# Altium schematic sheet Sheet5.SchDoc
size A4
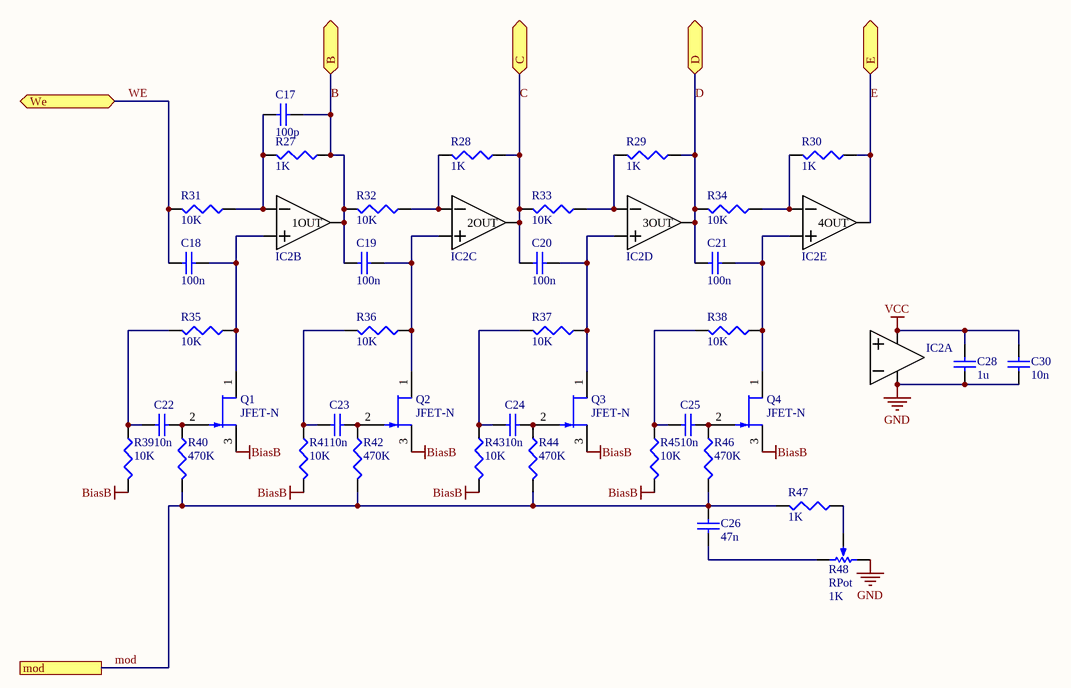
[diagram p0: Sheet5.SchDoc]

## Parts
C17  value 100p  [C1206]  (hidden comment: Cap Semi)
C18  value 100n  [C1206]  (hidden comment: Cap Semi)
C19  value 100n  [C1206]  (hidden comment: Cap Semi)
C20  value 100n  [C1206]  (hidden comment: Cap Semi)
C21  value 100n  [C1206]  (hidden comment: Cap Semi)
C22  value 10n  [C1206]  (hidden comment: Cap Semi)
C23  value 10n  [C1206]  (hidden comment: Cap Semi)
C24  value 10n  [C1206]  (hidden comment: Cap Semi)
C25  value 10n  [C1206]  (hidden comment: Cap Semi)
C26  value 47n  [C1206]  (hidden comment: Cap Semi)
C28  value 1u  [C1206]  (hidden comment: Cap Semi)
C30  value 10n  [C1206]  (hidden comment: Cap Semi)
IC2  TL074A  [TL074A]  (value not drawn)  (parts A,B,C,D,E of 5)
Q1  JFET-N  [TO-254-AA]
Q2  JFET-N  [TO-254-AA]
Q3  JFET-N  [TO-254-AA]
Q4  JFET-N  [TO-254-AA]
R27  value 1K  [J1-0603]  (hidden comment: Res3)
R28  value 1K  [J1-0603]  (hidden comment: Res3)
R29  value 1K  [J1-0603]  (hidden comment: Res3)
R30  value 1K  [J1-0603]  (hidden comment: Res3)
R31  value 10K  [J1-0603]  (hidden comment: Res3)
R32  value 10K  [J1-0603]  (hidden comment: Res3)
R33  value 10K  [J1-0603]  (hidden comment: Res3)
R34  value 10K  [J1-0603]  (hidden comment: Res3)
R35  value 10K  [J1-0603]  (hidden comment: Res3)
R36  value 10K  [J1-0603]  (hidden comment: Res3)
R37  value 10K  [J1-0603]  (hidden comment: Res3)
R38  value 10K  [J1-0603]  (hidden comment: Res3)
R39  value 10K  [J1-0603]  (hidden comment: Res3)
R40  value 470K  [J1-0603]  (hidden comment: Res3)
R41  value 10K  [J1-0603]  (hidden comment: Res3)
R42  value 470K  [J1-0603]  (hidden comment: Res3)
R43  value 10K  [J1-0603]  (hidden comment: Res3)
R44  value 470K  [J1-0603]  (hidden comment: Res3)
R45  value 10K  [J1-0603]  (hidden comment: Res3)
R46  value 470K  [J1-0603]  (hidden comment: Res3)
R47  value 1K  [J1-0603]  (hidden comment: Res3)
R48  RPot  value 1K  [VR5]

## Ports
B (bidir), C, D, E, mod, We

## Nets
BiasB: Q1.3(S) Q2.3(S) Q3.3(S) Q4.3(S) R39.2 R41.2 R43.2 R45.2
GND: C28.2 C30.2 IC2.11(VCC-) R48.1(TOP)
VCC: C28.1 C30.1 IC2.4(VCC+)
B: C17.1 C19.2 IC2.1(1OUT) R27.1 R32.2 ; port B
C: C20.2 IC2.7(2OUT) R28.1 R33.2 ; port C
D: C21.2 IC2.8(3OUT) R29.1 R34.2 ; port D
E: IC2.14(4OUT) R30.1 ; port E
mod: C26.1 R40.2 R42.2 R44.2 R46.2 R47.2 ; port mod
WE: C18.2 R31.2 ; port We
NetC17_2: C17.2 IC2.2(1IN-) R27.2 R31.1
NetC18_1: C18.1 IC2.3(1IN+) Q1.1(D) R35.1
NetC19_1: C19.1 IC2.5(2IN+) Q2.1(D) R36.1
NetC20_1: C20.1 IC2.10(3IN+) Q3.1(D) R37.1
NetC21_1: C21.1 IC2.12(4IN+) Q4.1(D) R38.1
NetC22_1: C22.1 Q1.2(G) R40.1
NetC22_2: C22.2 R35.2 R39.1
NetC23_1: C23.1 Q2.2(G) R42.1
NetC23_2: C23.2 R36.2 R41.1
NetC24_1: C24.1 Q3.2(G) R44.1
NetC24_2: C24.2 R37.2 R43.1
NetC25_1: C25.1 Q4.2(G) R46.1
NetC25_2: C25.2 R38.2 R45.1
NetC26_2: C26.2 R48.2(BOT)
NetIC2_6: IC2.6(2IN-) R28.2 R32.1
NetIC2_9: IC2.9(3IN-) R29.2 R33.1
NetIC2_13: IC2.13(4IN-) R30.2 R34.1
NetR47_1: R47.1 R48.3(TAP)

## Library data of the parts
C17-C26 C28 C30 = Cap Semi: Capacitor (Semiconductor SIM Model); Published: 8-Jun-2000; LatestRevisionDate: 29-May-2009; LatestRevisionNote: IPC-7351 Footprint Added.; PackageReference: C1206; Publisher: Altium Limited; PackageDescription: Chip Capacitor
IC2 = TL074A: TL074A Op-Amp; helpURL: http://www.ti.com/general/docs/lit/getliterature.tsp?genericPartNumber=tl074&fileType=pdf; Supplier 1: Digi-Key; Supplier 2: Farnell; Supplier 3: Mouser; Supplier 4: Newark; Supplier 5: Arrow; Supplier 6: Arrow; Supplier 7: Newark; Supplier Part Number 1: 296-14998-1-ND; Supplier Part Number 2: 9593349; Supplier Part Number 3: 595-TL074ACDR; Supplier Part Number 4: 98K1644; Supplier Part Number 5: TL074ACDR; Supplier Part Number 6: TL074ACDR**MULT1; Supplier Part Number 7: 85X7487
Q1-Q4 = JFET-N: N-Channel JFET; Published: 8-Jun-2000; LatestRevisionDate: 17-Jul-2002; LatestRevisionNote: Re-released for DXP Platform.; PackageReference: TO-254-AA; Publisher: Altium Limited; Code_JEDEC: TO-254-AA
R27-R47 = Res3: Resistor; Published: 8-Jun-2000; LatestRevisionDate: 29-May-2009; LatestRevisionNote: IPC-7351 Footprint Added.; PackageReference: J1-0603; Publisher: Altium Limited; PackageDescription: Chip Resistor
R48 = RPot: Potentiometer; Sim Note: Enter the Resistance value and the set point into parameter fields.; Set Position: 0.5; Published: 8-Jun-2000; LatestRevisionDate: 17-Jul-2002; LatestRevisionNote: Re-released for DXP Platform.; PackageReference: VR5; Publisher: Altium Limited; PackageDescription: Variable Resistor, Thru-Hole; 3 Leads